# Altium schematic sheet AVR128DB48_Curiosity_Nano_TopLevel.SchDoc
size A3; SheetTitle: Top Level; CompanyName: Microchip Technology Inc.; Organization: Microchip Technology; Address1: 2355 West Chandler Blvd.; Address2: Chandler, AZ  85224; Address4: USA; SheetNumber: 1; SheetTotal: 4; Time: Time
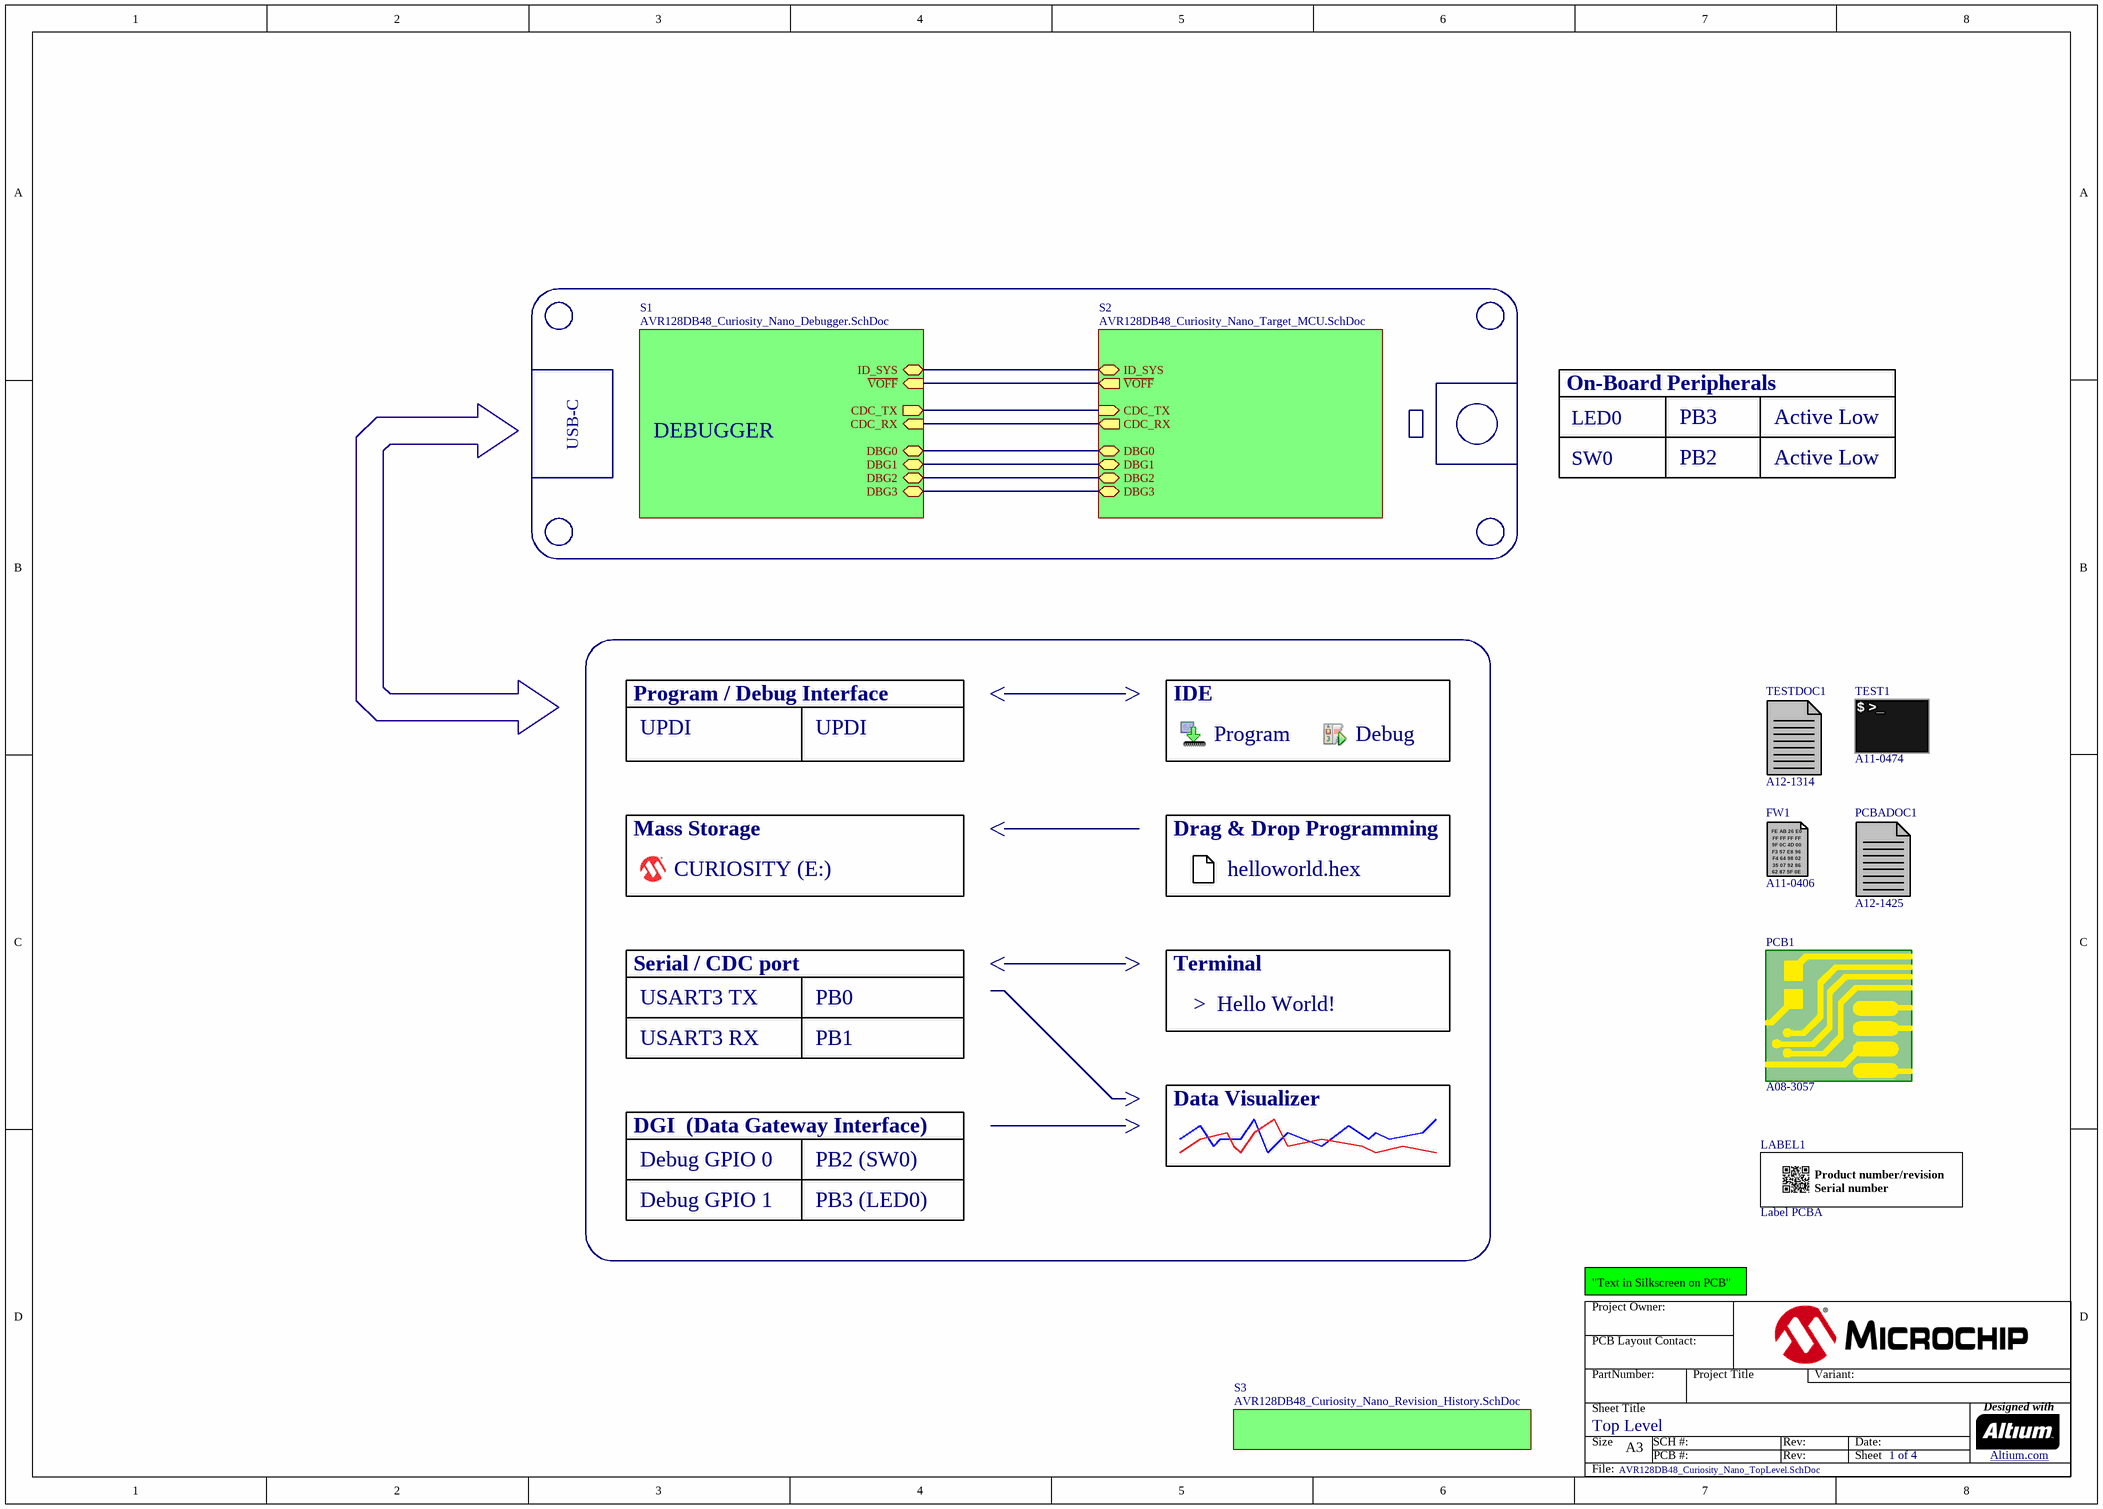
[diagram p0: AVR128DB48_Curiosity_Nano_TopLevel.SchDoc]

## Parts
FW1  AN: A11-0406  (mechanical)
LABEL1  value Label PCBA  [AP8-00317]
PCB1  AN: A08-3057  (mechanical)
PCBADOC1  AN: A12-1425  (mechanical)
TEST1  AN: A11-0474  (mechanical)
TESTDOC1  AN: A12-1314  (mechanical)

## Sub-sheets
S1 = AVR128DB48_Curiosity_Nano_Debugger.SchDoc: DBG2 (bidir), DBG1 (bidir), DBG3 (bidir), DBG0 (bidir), ~{VOFF} (in), ID_SYS (bidir), CDC_RX (in), CDC_TX (out)
S2 = AVR128DB48_Curiosity_Nano_Target_MCU.SchDoc: DBG0 (bidir), DBG1 (bidir), DBG3 (bidir), DBG2 (bidir), ~{VOFF} (out), ID_SYS (bidir), CDC_RX (out), CDC_TX (in)
S3 = AVR128DB48_Curiosity_Nano_Revision_History.SchDoc: no entries

## Nets
(unnamed): sheet S2/DBG0, sheet S1/DBG0
(unnamed): sheet S2/DBG1, sheet S1/DBG1
(unnamed): sheet S2/DBG3, sheet S1/DBG3
(unnamed): sheet S2/DBG2, sheet S1/DBG2
(unnamed): sheet S2/~{VOFF}, sheet S1/~{VOFF}
(unnamed): sheet S2/ID_SYS, sheet S1/ID_SYS
(unnamed): sheet S2/CDC_RX, sheet S1/CDC_RX
(unnamed): sheet S2/CDC_TX, sheet S1/CDC_TX

## Notes on the sheet
- USB-C
- DEBUGGER
- On-Board Peripherals
- LED0
- PB3
- Active Low
- SW0
- PB2
- Program / Debug Interface
- IDE
- UPDI
- Program
- Debug
- Mass Storage
- Drag & Drop Programming
- CURIOSITY (E:)
- helloworld.hex
- Serial / CDC port
- Terminal
- USART3 TX
- USART3 RX
- PB1
- PB0
- >  Hello World!
- Data Visualizer
- DGI  (Data Gateway Interface)
- Debug GPIO 0
- PB2 (SW0)
- Debug GPIO 1
- PB3 (LED0)
- "Text in Silkscreen on PCB"
- Project Owner:
- PCB Layout Contact:
- PartNumber:
- Project Title
- Variant:
- Sheet Title
- Size
- A3
- SCH #:
- PCB #:
- Rev:
- Date:
- Sheet
- Designed with
- Altium.com <http://go.altium.com/MicrochipLandingPage_Evaluation.html>
- File:
- (in symbol A09-0611) / Product number/revision / Serial number
- (in symbol A11-0406) FE AB 26 E0; FF FF FF FF; 9F 0C 4D 00; F3 57 E8 96; F4 64 98 02; 35 07 92 86; 62 87 5F 0E
- (in symbol A11-0474) $ >_

## Library data of the parts
FW1 = A11-0406: nEDBG firmware; PartGroup: Software,Firmware,Tools; Value: nEDBG firmware
LABEL1 = A09-0611: PCBA identification label PP Top White Gloss; Manufacturer: ACT Logimark AS; MPN: 505462; PartGroup: Mechanical devices,Packaging materials,Printed Labels,PCBA; AN: A09-0611
PCB1 = A08-3057: AVR128DB48 Curiosity Nano PCB Documentation; PartGroup: Mechanical devices,Printed circuit boards; Value: AVR128DB48 Curiosity Nano PCB Documentation
PCBADOC1 = A12-1425: AVR128DB48 Curiosity Nano PCBA Documentation; PartGroup: Documentation,PCBA Documents; Value: AVR128DB48 Curiosity Nano PCBA Documentation
TEST1 = A11-0474: Fixture test for AVR128DB48 Curiosity Nano; PartGroup: Software,Test software,Starter Kit; Value: AVR128DB48 Curiosity Nano Test
TESTDOC1 = A12-1314: Generic Test Instructions for Curiosity Nano; PartGroup: Documentation,Procedures,Test Instructions; Value: Curiosity Nano Test Instructions